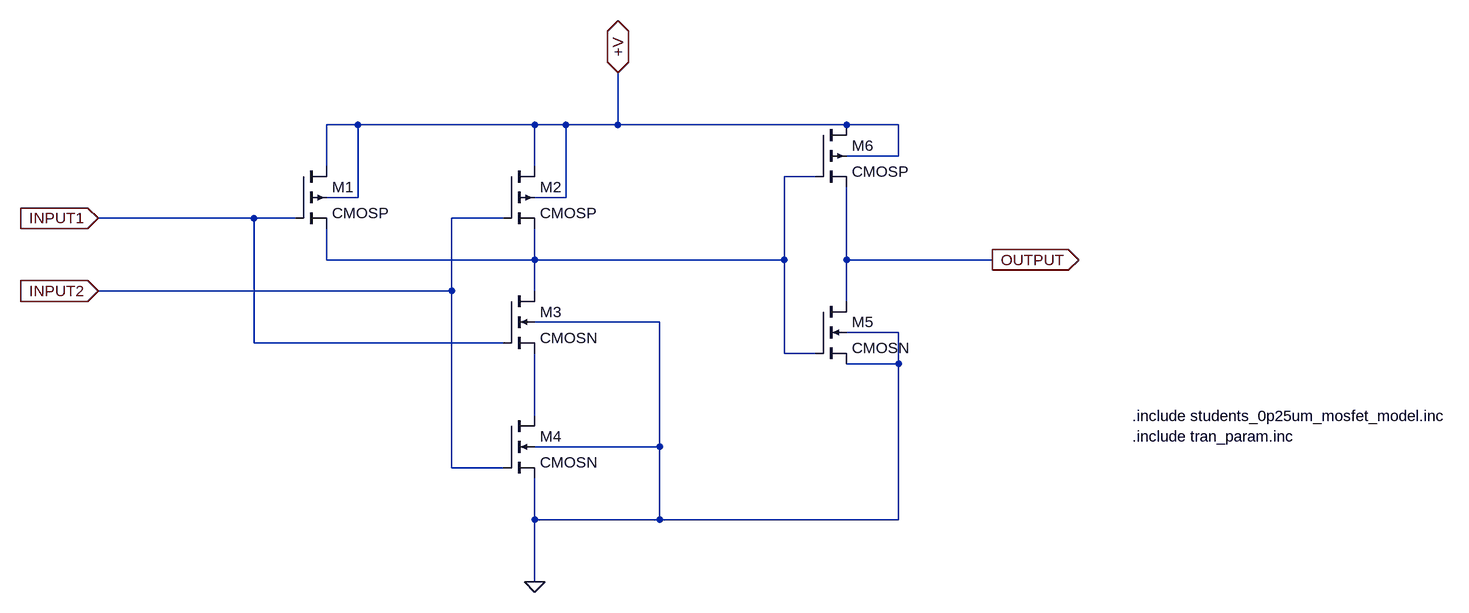
[diagram p0: schematic AND.asc]
AND.asc, the LTspice schematic file:
Version 4
SHEET 1 2812 1756
WIRE 224 -48 176 -48
WIRE 496 -48 224 -48
WIRE 544 -48 496 -48
WIRE 624 -48 624 -128
WIRE 624 -48 544 -48
WIRE 976 -48 624 -48
WIRE 1056 -48 976 -48
WIRE 1056 0 1056 -48
WIRE 1056 0 976 0
WIRE 176 16 176 -48
WIRE 496 16 496 -48
WIRE 928 32 880 32
WIRE 224 64 224 -48
WIRE 224 64 176 64
WIRE 544 64 544 -48
WIRE 544 64 496 64
WIRE 64 96 -176 96
WIRE 128 96 64 96
WIRE 448 96 368 96
WIRE 176 160 176 112
WIRE 496 160 496 112
WIRE 496 160 176 160
WIRE 880 160 880 32
WIRE 880 160 496 160
WIRE 976 160 976 48
WIRE 1200 160 976 160
WIRE 368 208 368 96
WIRE 368 208 -176 208
WIRE 496 208 496 160
WIRE 976 224 976 160
WIRE 688 256 496 256
WIRE 1056 272 976 272
WIRE 64 288 64 96
WIRE 448 288 64 288
WIRE 880 304 880 160
WIRE 928 304 880 304
WIRE 1056 320 1056 272
WIRE 1056 320 976 320
WIRE 496 400 496 304
WIRE 688 448 688 256
WIRE 688 448 496 448
WIRE 368 480 368 208
WIRE 448 480 368 480
WIRE 496 560 496 496
WIRE 688 560 688 448
WIRE 688 560 496 560
WIRE 1056 560 1056 320
WIRE 1056 560 688 560
WIRE 496 656 496 560
FLAG -176 96 INPUT1
IOPIN -176 96 In
FLAG -176 208 INPUT2
IOPIN -176 208 In
FLAG 1200 160 OUTPUT
IOPIN 1200 160 Out
FLAG 624 -128 +V
IOPIN 624 -128 BiDir
FLAG 496 656 0
SYMBOL pmos4 128 16 R0
SYMATTR InstName M1
SYMATTR Value CMOSP
SYMATTR Value2 l={LChan} w={WP} ad={ADP} as={ASP} pd={PDP} ps={PSP}
SYMBOL nmos4 448 208 R0
SYMATTR InstName M3
SYMATTR Value CMOSN
SYMATTR Value2 l={LChan} w={WN} ad={ADN} as={ASN} pd={PDN} ps={PSN}
SYMBOL pmos4 448 16 R0
SYMATTR InstName M2
SYMATTR Value CMOSP
SYMATTR Value2 l={LChan} w={WP} ad={ADP} as={ASP} pd={PDP} ps={PSP}
SYMBOL pmos4 928 -48 R0
SYMATTR InstName M6
SYMATTR Value CMOSP
SYMATTR Value2 l={LChan} w={WP} ad={ADP} as={ASP} pd={PDP} ps={PSP}
SYMBOL nmos4 448 400 R0
SYMATTR InstName M4
SYMATTR Value CMOSN
SYMATTR Value2 l={LChan} w={WN} ad={ADN} as={ASN} pd={PDN} ps={PSN}
SYMBOL nmos4 928 224 R0
SYMATTR InstName M5
SYMATTR Value CMOSN
SYMATTR Value2 l={LChan} w={WN} ad={ADN} as={ASN} pd={PDN} ps={PSN}
TEXT 1416 400 Left 2 !.include students_0p25um_mosfet_model.inc
TEXT 1416 432 Left 2 !.include tran_param.inc

The netlist it stands for:
* AND.asc
M1 +V INPUT1 N001 +V CMOSP l={LChan} w={WP} ad={ADP} as={ASP} pd={PDP} ps={PSP}
M3 N001 INPUT1 N002 0 CMOSN l={LChan} w={WN} ad={ADN} as={ASN} pd={PDN} ps={PSN}
M2 +V INPUT2 N001 +V CMOSP l={LChan} w={WP} ad={ADP} as={ASP} pd={PDP} ps={PSP}
M6 +V N001 OUTPUT +V CMOSP l={LChan} w={WP} ad={ADP} as={ASP} pd={PDP} ps={PSP}
M4 N002 INPUT2 0 0 CMOSN l={LChan} w={WN} ad={ADN} as={ASN} pd={PDN} ps={PSN}
M5 OUTPUT N001 0 0 CMOSN l={LChan} w={WN} ad={ADN} as={ASN} pd={PDN} ps={PSN}
.model NMOS NMOS
.model PMOS PMOS
.lib standard.mos
.include students_0p25um_mosfet_model.inc
.include tran_param.inc
.backanno
.end